# Altium project M5TC-2020-U4BN01A(01).PrjPcb
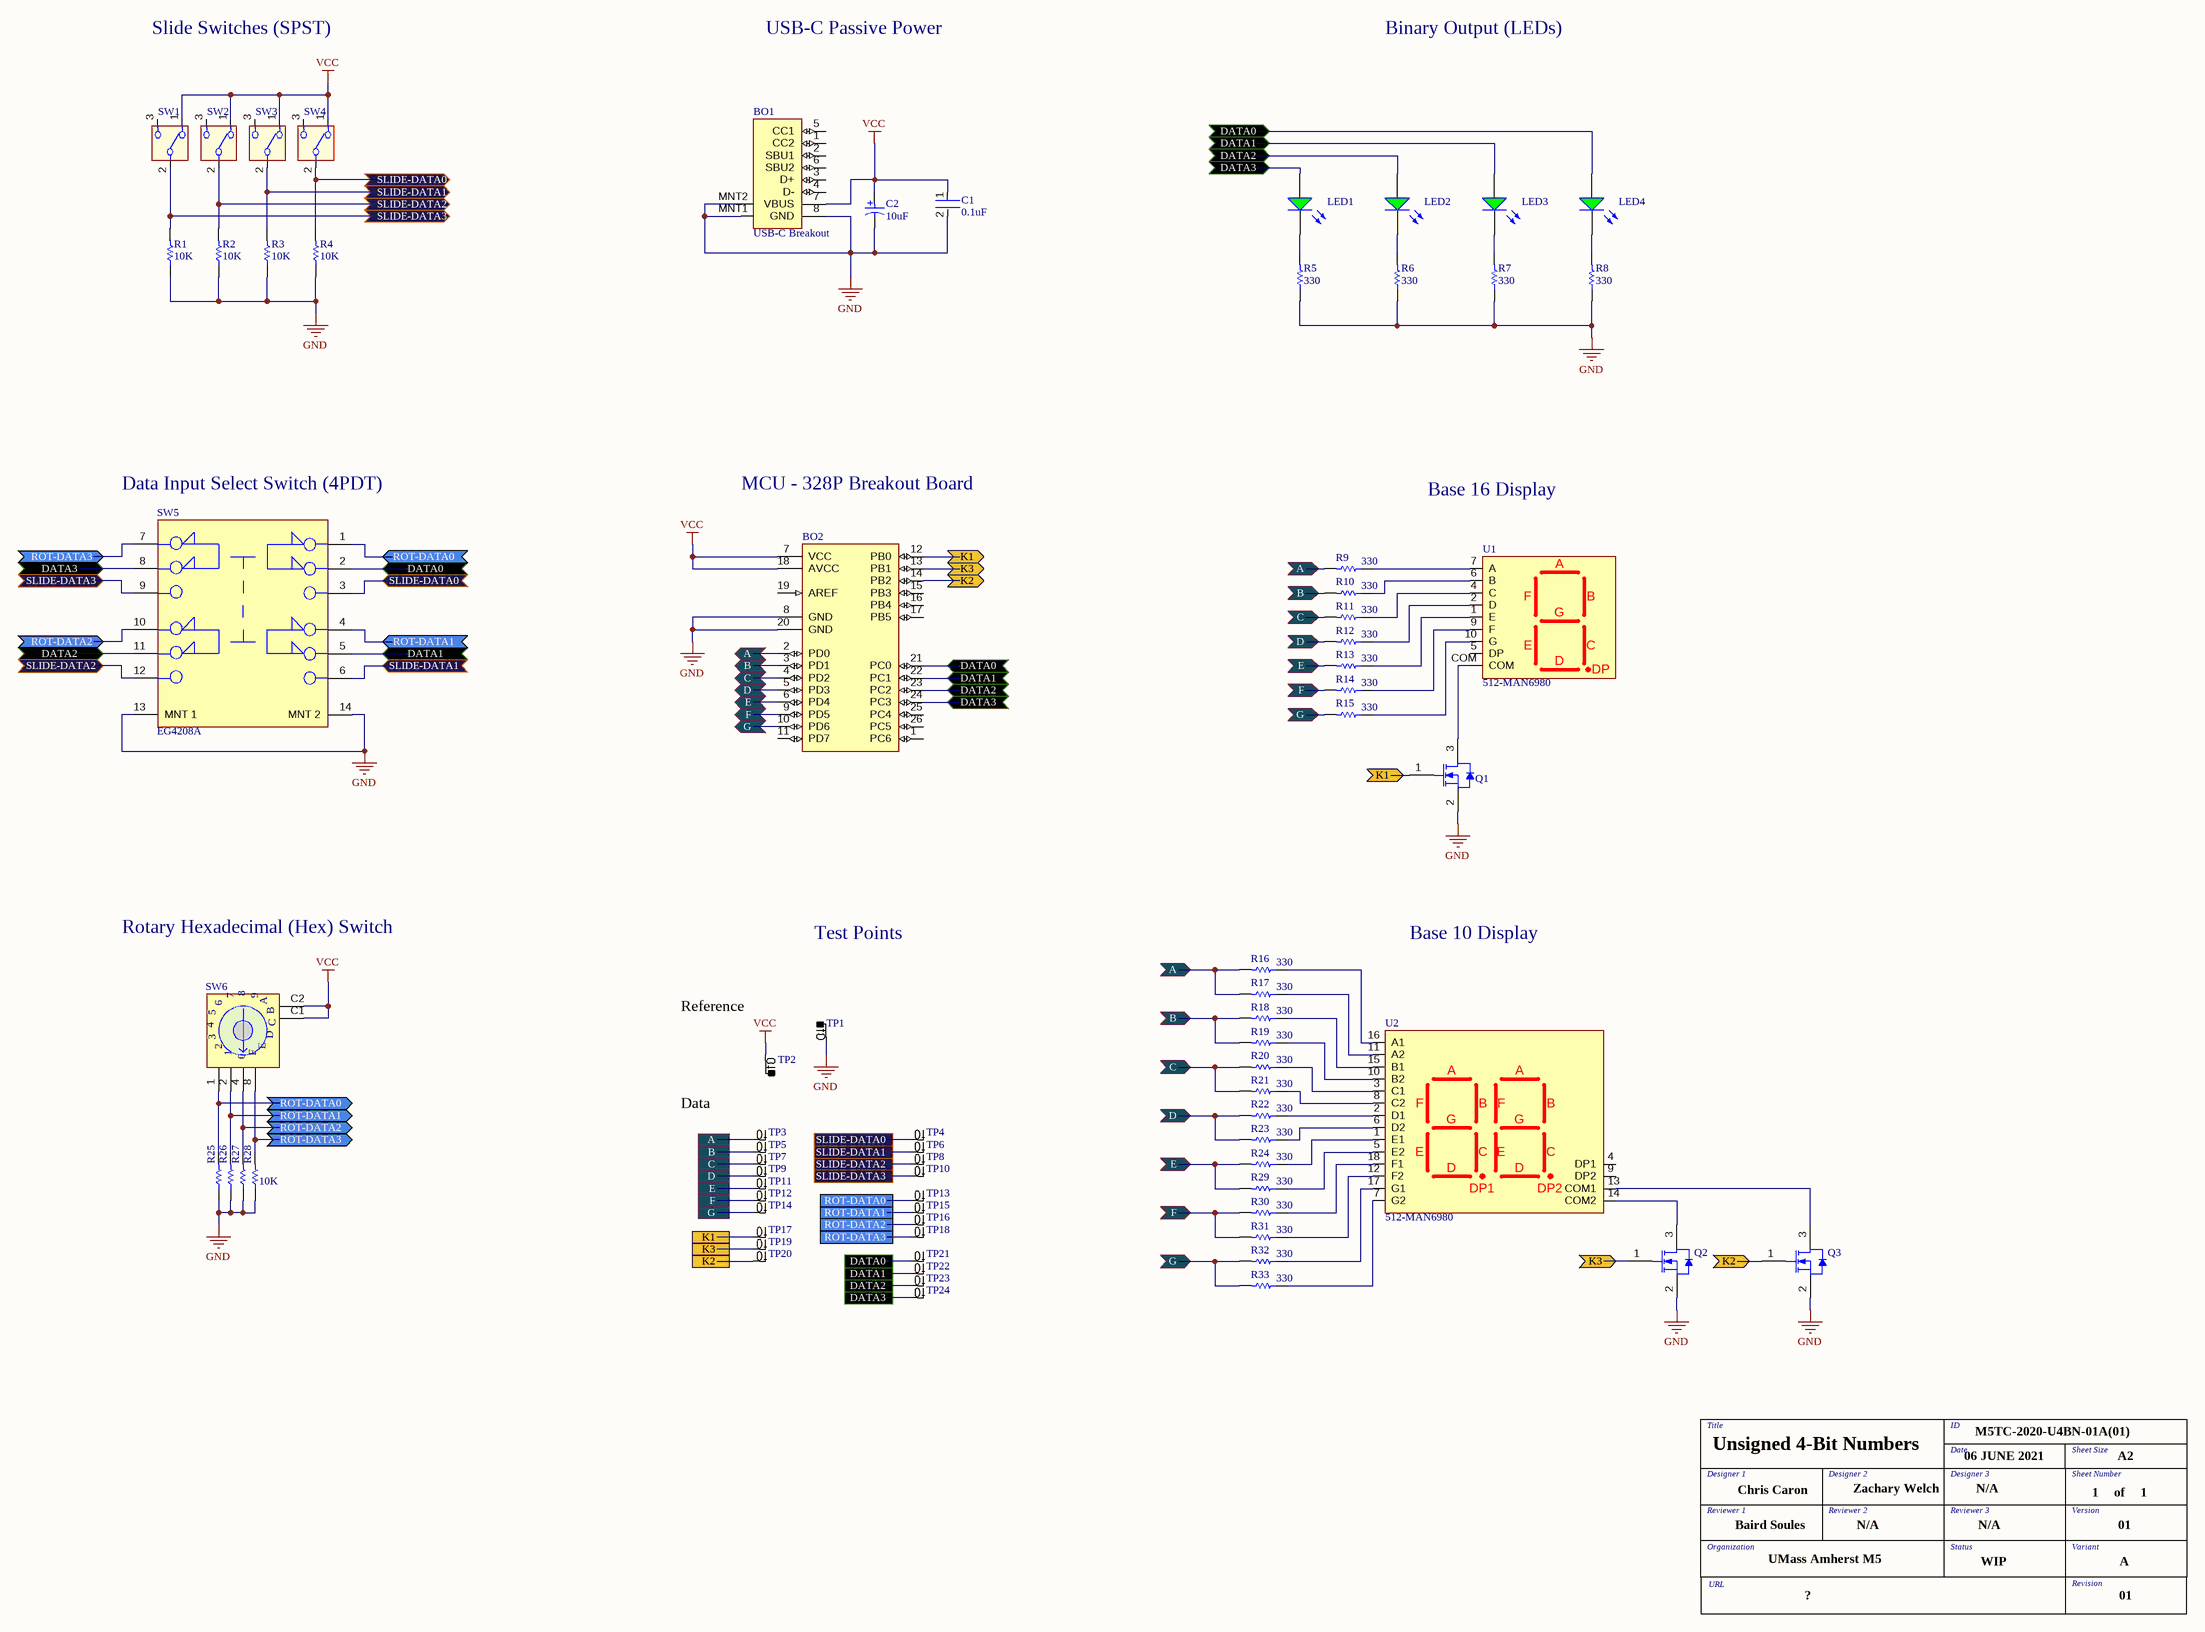
[diagram p0: U4BNV1 Schematic.SchDoc]
1 sheet, 77 parts. Net scope: global (net labels, ports and power ports of the same name join across sheets).
Board file: U4BNV1 PCB.PcbDoc

## Sheet U4BNV1 Schematic.SchDoc: Unsigned 4-Bit Numbers
size A2; DrawnBy: Chris Caron; Organization: M5 makerspace; Address1: Electrical and Computer Engineering; Address2: UMass Amherst; Address4: Chris Caron; Revision: 01; SheetNumber: 1; SheetTotal: 1; M5TCID: M5TC-2020-U4BN-01A(01); Version: 01; SheetSize: A2; Status: WIP; Designer1: Chris Caron; Reviewer1: Baird Soules; CustomDate: 06 JUNE 2021; URL: ?; Variant: A; abbrev: U4BN; Designer2: Zachary Welch; Designer3: N/A; Reviewer2: N/A; Reviewer3: N/A; year: 2020

### Parts
BO1  USB-C Breakout  [USB-C Breakout]
BO2  (no value)  [328P-BOB]
C1  0.1uF  [FP-C0603-CJ-MFG]
C2  10uF  [KEMT-A-3216-18-2_M]
LED1  HLMP-4740  [AVAG-HLMP-4740]  (value not drawn)
LED2  HLMP-4740  [AVAG-HLMP-4740]  (value not drawn)
LED3  HLMP-4740  [AVAG-HLMP-4740]  (value not drawn)
LED4  HLMP-4740  [AVAG-HLMP-4740]  (value not drawn)
Q1  FDN337N  [FAIR-SSOT3L-3_V]  (value not drawn)
Q2  FDN337N  [FAIR-SSOT3L-3_V]  (value not drawn)
Q3  FDN337N  [FAIR-SSOT3L-3_V]  (value not drawn)
R1  10K  [RESC1608X55X30LL10T20_B]
R2  10K  [RESC1608X55X30LL10T20_B]
R3  10K  [RESC1608X55X30LL10T20_B]
R4  10K  [RESC1608X55X30LL10T20_B]
R5  330  [RESC1608X55X25NL10T15]
R6  330  [RESC1608X55X25NL10T15]
R7  330  [RESC1608X55X25NL10T15]
R8  330  [RESC1608X55X25NL10T15]
R9  330  [RESC1608X55X25NL10T15]
R10  330  [RESC1608X55X25NL10T15]
R11  330  [RESC1608X55X25NL10T15]
R12  330  [RESC1608X55X25NL10T15]
R13  330  [RESC1608X55X25NL10T15]
R14  330  [RESC1608X55X25NL10T15]
R15  330  [RESC1608X55X25NL10T15]
R16  330  [RESC1608X55X25NL10T15]
R17  330  [RESC1608X55X25NL10T15]
R18  330  [RESC1608X55X25NL10T15]
R19  330  [RESC1608X55X25NL10T15]
R20  330  [RESC1608X55X25NL10T15]
R21  330  [RESC1608X55X25NL10T15]
R22  330  [RESC1608X55X25NL10T15]
R23  330  [RESC1608X55X25NL10T15]
R24  330  [RESC1608X55X25NL10T15]
R25  10K  [RESC1609X55X30ML10T20]  (value not drawn)
R26  10K  [RESC1609X55X30ML10T20]  (value not drawn)
R27  10K  [RESC1609X55X30ML10T20]  (value not drawn)
R28  10K  [RESC1609X55X30ML10T20]
R29  330  [RESC1608X55X25NL10T15]
R30  330  [RESC1608X55X25NL10T15]
R31  330  [RESC1608X55X25NL10T15]
R32  330  [RESC1608X55X25NL10T15]
R33  330  [RESC1608X55X25NL10T15]
SW1  SPDT SLIDE 48ASSP1S1M2RBT  [SPDT SLIDE 48ASSP1S1M2RBT]  (value not drawn)
SW2  SPDT SLIDE 48ASSP1S1M2RBT  [SPDT SLIDE 48ASSP1S1M2RBT]  (value not drawn)
SW3  SPDT SLIDE 48ASSP1S1M2RBT  [SPDT SLIDE 48ASSP1S1M2RBT]  (value not drawn)
SW4  SPDT SLIDE 48ASSP1S1M2RBT  [SPDT SLIDE 48ASSP1S1M2RBT]  (value not drawn)
SW5  EG4208A  [FP-EG4208A-MFG]
SW6  428521420916  [428521420916]  (value not drawn)
Tb1  Title Block  (value not drawn)
TP1  Loop post and pad test point  [TEST POINT (LOOP/POST/PAD)]  (value not drawn)
TP2  Loop post and pad test point  [TEST POINT (LOOP/POST/PAD)]  (value not drawn)
TP3  Loop and post test point  [TEST POINT (LOOP/POST)]  (value not drawn)
TP4  Loop and post test point  [TEST POINT (LOOP/POST)]  (value not drawn)
TP5  Loop and post test point  [TEST POINT (LOOP/POST)]  (value not drawn)
TP6  Loop and post test point  [TEST POINT (LOOP/POST)]  (value not drawn)
TP7  Loop and post test point  [TEST POINT (LOOP/POST)]  (value not drawn)
TP8  Loop and post test point  [TEST POINT (LOOP/POST)]  (value not drawn)
TP9  Loop and post test point  [TEST POINT (LOOP/POST)]  (value not drawn)
TP10  Loop and post test point  [TEST POINT (LOOP/POST)]  (value not drawn)
TP11  Loop and post test point  [TEST POINT (LOOP/POST)]  (value not drawn)
TP12  Loop and post test point  [TEST POINT (LOOP/POST)]  (value not drawn)
TP13  Loop and post test point  [TEST POINT (LOOP/POST)]  (value not drawn)
TP14  Loop and post test point  [TEST POINT (LOOP/POST)]  (value not drawn)
TP15  Loop and post test point  [TEST POINT (LOOP/POST)]  (value not drawn)
TP16  Loop and post test point  [TEST POINT (LOOP/POST)]  (value not drawn)
TP17  Loop and post test point  [TEST POINT (LOOP/POST)]  (value not drawn)
TP18  Loop and post test point  [TEST POINT (LOOP/POST)]  (value not drawn)
TP19  Loop and post test point  [TEST POINT (LOOP/POST)]  (value not drawn)
TP20  Loop and post test point  [TEST POINT (LOOP/POST)]  (value not drawn)
TP21  Loop and post test point  [TEST POINT (LOOP/POST)]  (value not drawn)
TP22  Loop and post test point  [TEST POINT (LOOP/POST)]  (value not drawn)
TP23  Loop and post test point  [TEST POINT (LOOP/POST)]  (value not drawn)
TP24  Loop and post test point  [TEST POINT (LOOP/POST)]  (value not drawn)
U1  Supplier Part Number 1: 512-MAN6980  [MAN6980]  (hidden comment: Single Digit CC)
U2  Supplier Part Number 1: 512-MAN6980  [MAN6940]  (hidden comment: 2 Digit MAN6940)

### Nets
GND: BO1.8(GND) BO1.MNT1 BO1.MNT2 BO2.8(GND) BO2.20(GND) C1.2 C2.2 Q1.2(S) Q2.2(S) Q3.2(S) R1.1 R2.1 R3.1 R4.1 R5.1 R6.1 R7.1 R8.1 R25.1 R26.1 R27.1 R28.1 SW5.13(MNT_1) SW5.14(MNT_2) TP1.1
VCC: BO1.7(VBUS) BO2.7(VCC) BO2.18(AVCC) C1.1 C2.1 SW1.1 SW2.1 SW3.1 SW4.1 SW6.C1 SW6.C2 TP2.1
A: BO2.2(PD0) R9.2 R16.2 R17.2 TP3.1
B: BO2.3(PD1) R10.2 R18.2 R19.2 TP5.1
C: BO2.4(PD2) R11.2 R20.2 R21.2 TP7.1
D: BO2.5(PD3) R12.2 R22.2 R23.2 TP9.1
DATA0: BO2.21(PC0) LED4.1(A) SW5.2 TP21.1
DATA1: BO2.22(PC1) LED3.1(A) SW5.5 TP22.1
DATA2: BO2.23(PC2) LED2.1(A) SW5.11 TP23.1
DATA3: BO2.24(PC3) LED1.1(A) SW5.8 TP24.1
E: BO2.6(PD4) R13.2 R24.2 R29.2 TP11.1
F: BO2.9(PD5) R14.2 R30.2 R31.2 TP12.1
G: BO2.10(PD6) R15.2 R32.2 R33.2 TP14.1
K1: BO2.12(PB0) Q1.1(G) TP17.1
K2: BO2.14(PB2) Q3.1(G) TP20.1
K3: BO2.13(PB1) Q2.1(G) TP19.1
ROT-DATA0: R25.2 SW5.1 SW6.1 TP13.1
ROT-DATA1: R26.2 SW5.4 SW6.2 TP15.1
ROT-DATA2: R27.2 SW5.10 SW6.4 TP16.1
ROT-DATA3: R28.2 SW5.7 SW6.8 TP18.1
SLIDE-DATA0: R4.2 SW4.2 SW5.3 TP4.1
SLIDE-DATA1: R3.2 SW3.2 SW5.6 TP6.1
SLIDE-DATA2: R2.2 SW2.2 SW5.12 TP8.1
SLIDE-DATA3: R1.2 SW1.2 SW5.9 TP10.1
NetLED1_2: LED1.2(K) R5.2
NetLED2_2: LED2.2(K) R6.2
NetLED3_2: LED3.2(K) R7.2
NetLED4_2: LED4.2(K) R8.2
NetQ1_3: Q1.3(D) U1.COM
NetQ2_3: Q2.3(D) U2.14(COM2)
NetQ3_3: Q3.3(D) U2.13(COM1)
NetR9_1: R9.1 U1.7(A)
NetR10_1: R10.1 U1.6(B)
NetR11_1: R11.1 U1.4(C)
NetR12_1: R12.1 U1.2(D)
NetR13_1: R13.1 U1.1(E)
NetR14_1: R14.1 U1.9(F)
NetR15_1: R15.1 U1.10(G)
NetR16_1: R16.1 U2.16(A1)
NetR17_1: R17.1 U2.11(A2)
NetR18_1: R18.1 U2.15(B1)
NetR19_1: R19.1 U2.10(B2)
NetR20_1: R20.1 U2.3(C1)
NetR21_1: R21.1 U2.8(C2)
NetR22_1: R22.1 U2.2(D1)
NetR23_1: R23.1 U2.6(D2)
NetR24_1: R24.1 U2.1(E1)
NetR29_1: R29.1 U2.5(E2)
NetR30_1: R30.1 U2.18(F1)
NetR31_1: R31.1 U2.12(F2)
NetR32_1: R32.1 U2.17(G1)
NetR33_1: R33.1 U2.7(G2)

Not connected (* = marked no-connect by the designer): BO1 1(CC2) 2(SBU1) 3(D+) 4(D-) 5(CC1) 6(SBU2); BO2 1(PC6) 11(PD7) 15(PB3) 16(PB4) 17(PB5) 19(AREF) 25(PC4) 26(PC5); SW1 3(0); SW2 3(0); SW3 3(0); SW4 3(0); U1 5(DP); U2 4(DP1) 9(DP2)

### Notes on the sheet
- Slide Switches (SPST)
- USB-C Passive Power
- Binary Output (LEDs)
- Data Input Select Switch (4PDT)
- MCU - 328P Breakout Board
- Base 16 Display
- Rotary Hexadecimal (Hex) Switch
- Test Points
- Base 10 Display
- Reference
- Data
- DWG. NO.
- REV.
- SHT.
- THIS DOCUMENT AND THE DATA DISCLOSED HEREIN OR HEREWITH IS THE PROPERTY OF ALTIUM LIMITED AND MAY BE FREELY DISTRIBUTED IN WHOLE. NO RIGHTS ARE RESERVED OR EXPRESS OR IMPLIED WARANTEE GIVEN.
- REVISION
- DESCRIPTION
- DATE
- APPROVED
- ENG:
- APPROVALS
- PROJECT
- DSN:
- CHK:
- REFERENCE DOCUMENTS
- PROJECT REVISION:
- TITLE
- DOCUMENT REVISION:
- DESIGN ITEM:
- BOM:
- FAB DWG:
- PCB DWG:
- ASSY DWG:
- SCALE:
- SIZE
- B
- CAGE CODE
- FILE NAME
- DWG NO.
- SHEET
- OF
- REV
- (in symbol 7 Seg 2 Digit MAN6940) A; F; B; G; E; C; D
- (in symbol CMP-1446-00007-1) 7; 9; 6; A; B; 5; C; D; 3; E; F; 0
- (in symbol Title Block) Title; ID; Date; Sheet Size; Designer 1; Designer 2; Designer 3; Sheet Number; of; Reviewer 1; Reviewer 2; Reviewer 3; Version; Organization; Status; Variant; UMass Amherst M5; URL; Revision

### Library data of the parts
BO2 = 328P-BOB: Custom Breakout Board for 328P-PU
C1 = CMP-2006-03300-2: CAP CER 0.1UF 50V X7R 0603; Manufacturer Part Number: C0603X104K5RACTU; Manufacturer: Kemet; Capacitance: 100nF; Material: Ceramic; Tolerance: 10%; Value: 100nF; Temperature Coefficient: 15%; Temperature Range High: +125°C; Temperature Range Low: -55°C; Voltage: 50V; ComponentLink2Description: Datasheet; RoHS: TRUE; ComponentLink2URL: https://content.kemet.com/datasheets/KEM_C1013_X7R_FT-CAP_SMD.pdf; Device Class L3: Ceramic Capacitors; Device Class L2: Capacitors; Package: C0603-CJ; Height: 0.95mm; Device Class L1: Passive Components; Temperature Characteristic: X7R; Lead Free: Yes; Digikey Description: CAP CER 0.1UF 50V X7R 0603; Automotive: No; Mouser Description: Capacitor; Ceramic; Cap 0.1uF; Tol+10%; SMT; Flexible Termination; Vol-Rtg 50V; TR; Temperature: -55°C to +125°C; Octopart: https://octopart.com/c0603x104k5ractu-kemet-9145062; Category: Cap; Voltage Rating: 50V; Ipc Land Pattern Name: CAPC16080X80
C2 = CMP-2000-05172-1: Capacitor, Tantalum, 10 uF, +/- 10%, 10 V, -55 to 125 degC, 2-Pin SMD (1206), RoHS, Tape and Reel; Manufacturer Size Code: A; Manufacturer: Kemet; Type: Molded; Online Catalog: T491Series; Other Names: 399-3684-2; Voltage - Rated: 10V; Lifetime @ Temp.: 2000Hrs@85degC; Product Training Modules: CapacitorBasics-TypicalUsesforCapacitorsDeratingGuidelinesforSurfaceMountTantalumCapacitors; ESR (Equivalent Series Resistance): 3.8Ohm; Capacitance: 10µF; Catalog Drawings: T49x,T5xxSeries_A-side1T49x,T5xxSeries_A,B-side2T49x,T5xxSeries_A,SBottom; Family: TantalumCapacitors; Manufacturer URL: http://www.kemet.com/; Datasheet URL: http://www.farnell.com/datasheets/1824869.pdf; Package Reference: 1206; Packaging: Tape&Reel(TR); Series: T491; Operating Temperature: -55degC~125degC; Mounting Type: SurfaceMount; Height - Seated (Max): 0.071"(1.80mm); Package / Case: 1206(3216Metric); Package Description: 2-Pin Surface Mount Device, Body 3.2 x 1.6 mm; Features: GeneralPurpose; Tolerance: ±10%; Lead Spacing: -; Size / Dimension: 0.126"Lx0.063"W(3.20mmx1.60mm); Standard Package: 2,000; Datasheet Version: Apr-14; Category: Capacitors
LED1-LED4 = CMP-2000-06413-1: T-1 3/4 (5 mm) Low Current LED Lamp, Green, 1.9 V, -20 to 100 degC, 2-Pin THD, RoHS, Bulk; Manufacturer: AvagoTechnologies; Type: Uni-Color; Peak Wavelength: 565nm; Rad Hard: No; Viewing Angle: 50°; Dominant Wavelength/Color Temperature: 569nm; Number of LEDs: 1; Lens Appearance: ColoredDiffused; Lens Shape Type: Circular; Mounting Orientation: TopMount; Intensity: 2.3mcd; Datasheet Version: 07/2014; Category: LEDs; Datasheet URL: http://docs.avagotech.com/docs/AV02-1557EN; Packaging: Bulk; Pin Count: 2; Mounting Technology: ThroughHole; Package Reference: HLMP-4740; Mounting: ThroughHole; Manufacturer URL: http://www.avagotech.com/; Color: Green; Package: 2T-13/4; Package Description: 2-Pin Through Hole Device, Dia 5.845 mm, Pitch 2.54 mm
Q1-Q3 = CMP-2000-06250-1: N-Channel Logic Level Enhancement Mode Field Effect Transistor,2.2 A, 30 V, -55 to 150 degC, 3-Pin SOT-23, RoHS, Tape and Reel; Manufacturer: Fairchild Semiconductor; Transistor Polarity: NChannel; RDS(on): 0.082Ohm; External Depth: 2.5mm; Reel Quantity: 3000; Threshold Voltage Vgs Typ: 700mV; Current Id Max: 2.2A; External Length / Height: 1.12mm; No. of Pins: 3; Vgss: +/-8V; Voltage Vgs Rds on Measurement: 4.5V; Power Dissipation Pd: 500mW; Full Power Rating Temperature: 25°C; Pulse Current Idm: 10A; Vdss: 30V; Continuous Drain Current Id: 2.5A; SMD Marking: 337; No. of Transistors: 1; SVHC: NoSVHC(19-Dec-2012); Package Version: Rev. 3, 05/2015; Vth: 0.7V; Drain Source Voltage Vds: 20V; On Resistance Rds(on): 52mohm; Trr: 10ns; External Width: 3.05mm; Operating Temperature Range: -55°Cto+150°C; Operating Temperature Min: -55°C; Package / Case: SOT-23; Operating Temperature Max: 150°C; Manufacturer URL: https://www.fairchildsemi.com/; Id: 2.2A; Mounting Technology: SurfaceMount; Rds(on) Test Voltage Vgs: 4.5V; Voltage Vds Typ: 30V; Datasheet Version: Rev. C, 03/1998; Transistor Case Style: SOT-23; Termination Type: SMD; Package Reference: SSOT3L; Package Description: 3-Pin Small Outline Transistor, Body 2.92 x 1.4 mm, Pitch 0.95 mm; Voltage Vgs Max: 700mV; Tape Width: 8mm; Datasheet URL: https://www.fairchildsemi.com/datasheets/FD/FDN337N.pdf; Package URL: https://www.fairchildsemi.com/package-drawings/MA/MA03B.pdf; Current Temperature: 25°C
R1-R4 = CMP-2000-07508-1: Chip Resistor, 10 KOhm, +/- 1%, 0.1 W, -55 to 125 degC, 0603 (1608 Metric), RoHS, Tape and Reel; Manufacturer: TE Connectivity; Resistance: 10KOhm; Power Rating: 100mW; Number of Resistors: 1; Case\/Package: 0603; Temperature Coefficient: 100ppm\/degreesC; Voltage Rating: 50V; Depth: 0.8mm; Package Description: 2-Pin Surface Mount Device, Body 1.6 x 0.8 mm; Package Reference: 603; Max Operating Temperature: 125degC; Datasheet Version: Rev. BA, 10/2008; Radiation Hardening: No; Termination: Solder; Tolerance: 1%; Min Operating Temperature: -55degC; Height: 0.45mm; Mounting Technology: SurfaceMount; Length: 1.6mm; Number of Terminations: 2; RoHSCompliant: true; Composition: ThickFilm; Datasheet URL: http://www.te.com/commerce/DocumentDelivery/DDEController?Action=showdoc&DocId=Customer+Drawing%7F1622829%7FBA%7Fpdf%7FEnglish%7FENG_CD_1622829_BA.pdf%7F1622829-1; Mount: SurfaceMount; Manufacturer URL: http://www.te.com/; ELV: Compliant; Packaging: TapeandReel
R5-R24 R29-R33 = CMP-1659-00020-2: Chip Resistor, 330 Ohm, +/- 1%, 0.1 W, -55 to 155 degC, 0603 (1608 Metric), RoHS, Tape and Reel; Tolerance: 10%; ESR: 800 mohm; Voltage Rating (DC): 16 V; Capacitance: 47 uF; Length: 7.3 mm; ComponentLink1URL: http://www.yageo.com/; Packaging: Tape and Reel; Pins: 2; ComponentLink1Description: Manufacturer URL; Case Code (Imperial): 2917; REACH SVHC: No SVHC; Width: 4.3 mm; ComponentLink2Description: Datasheet; Voltage Rating: 16 V; RoHSCompliant: True; Max Operating Temperature: 125degC; ComponentLink2URL: http://www.yageo.com/documents/recent/PYu-RC_Group_51_RoHS_L_04.pdf; Min Operating Temperature: -55degC; Case/Package: 2917; Radiation Hardening: No; DatasheetVersion: Rev. 4, 02/2016; Mount: Surface Mount; PackageReference: 0603; Package Quantity: 500; Case Code (Metric): 7343; PackageDescription: 2-Pin Surface Mount Device, Body 1.6 x 0.8 mm; Height: 3.1 mm
R25-R28 = CMP-2000-03693-1: Res Thin Film 0603 10K Ohm 0.1% 1/10W ±25ppm/°C Molded SMD SMD Paper T/R; Part Number: TNPW060310K0BETA; Manufacturer: Vishay Dale
SW1-SW4 = SPDT SLIDE 48ASSP1S1M2RBT: SWITCH SLIDE SPDT 0.4VA 20V
SW5 = CMP-17877-000001-1: SWITCH SLIDE 4PDT 200MA 30V; Manufacturer: E-Switch; Contact Resistance: 200mΩ; Standoff Height: 0.7mm; Electromechanical Life: 10000Cycles; Automotive: No; Temperature Range Low: -20°C; Footprint Url: http://spec_sheets.e-switch.com/specs/P040281.pdf; Temperature: -20°C to +70°C; Device Class L1: Electromechanical; RoHS: TRUE; Temperature Range High: +70°C; Throw Configuration: 4PDT; ComponentLink2URL: https://www.e-switch.com/system/asset/product_line/data_sheet/119/EG.pdf; Mount: Through Hole; Height: 5.4mm; Device Class L3: Slide Switches; Category: Switch; Lead Free: Yes; Manufacturer Part Number: EG4208A; Package: EG4208A; Digikey Description: SWITCH SLIDE 4PDT 200MA 30V; Device Class L2: Switches; Mouser Description: Slide Switches 4P2T SIDE OP PC MNT; Octopart: https://octopart.com/eg4208a-e-switch-1221143; ComponentLink2Description: Datasheet
SW6 = CMP-1446-00007-1: WS-ROSV SMD Rotary Switch 10x10 mm; Manufacturer: Wuerth Elektronik; NoPins: 06; ComponentLink2URL: http://katalog.we-online.de/em/datasheet/428521420916.pdf; ComponentLink1URL: http://www.we-online.com; PackageReference: 428521420916; ComponentLink1Description: Manufacturer URL; ComponentLink2Description: Datasheet; PartNumber: 428521420916
TP1 TP2 = Test Point (Loop/Post/Pad): Requires 1 Keystone Electronics PC Test Point Multipurpose (see 5011 for example); Supplier 1: Digi-Key; Supplier Part Number 1: 36-5011-ND
TP3-TP24 = Test Point (Loop/Post): Requires 1 Keystone Electronics PC Test Point Multipurpose (see 5011 for example); ComponentLink1Description: Digi-Key; ComponentLink1URL: https://www.digikey.com/en/products/detail/keystone-electronics/5011/255333; Supplier 1: Digi-Key; Supplier Part Number 1: 36-5011-ND
U1 = 7 Seg 1 Digit MAN6980: MAN6980 RED SINGLE DIGIT COMMON CATHODE RT. HAND DECIMAL - FAIRCHILD SEMICONDUCTOR; pin to pad: COM>3+8; Supplier 1: Mouser
U2 = 7 Seg 2 Digit MAN6940: MAN6940 RED DOUBLE DIGIT COMMON CATHODE RT. HAND DECIMAL - FAIRCHILD SEMICONDUCTOR; Supplier 1: Mouser